# Altium project CNCX.PrjPcb
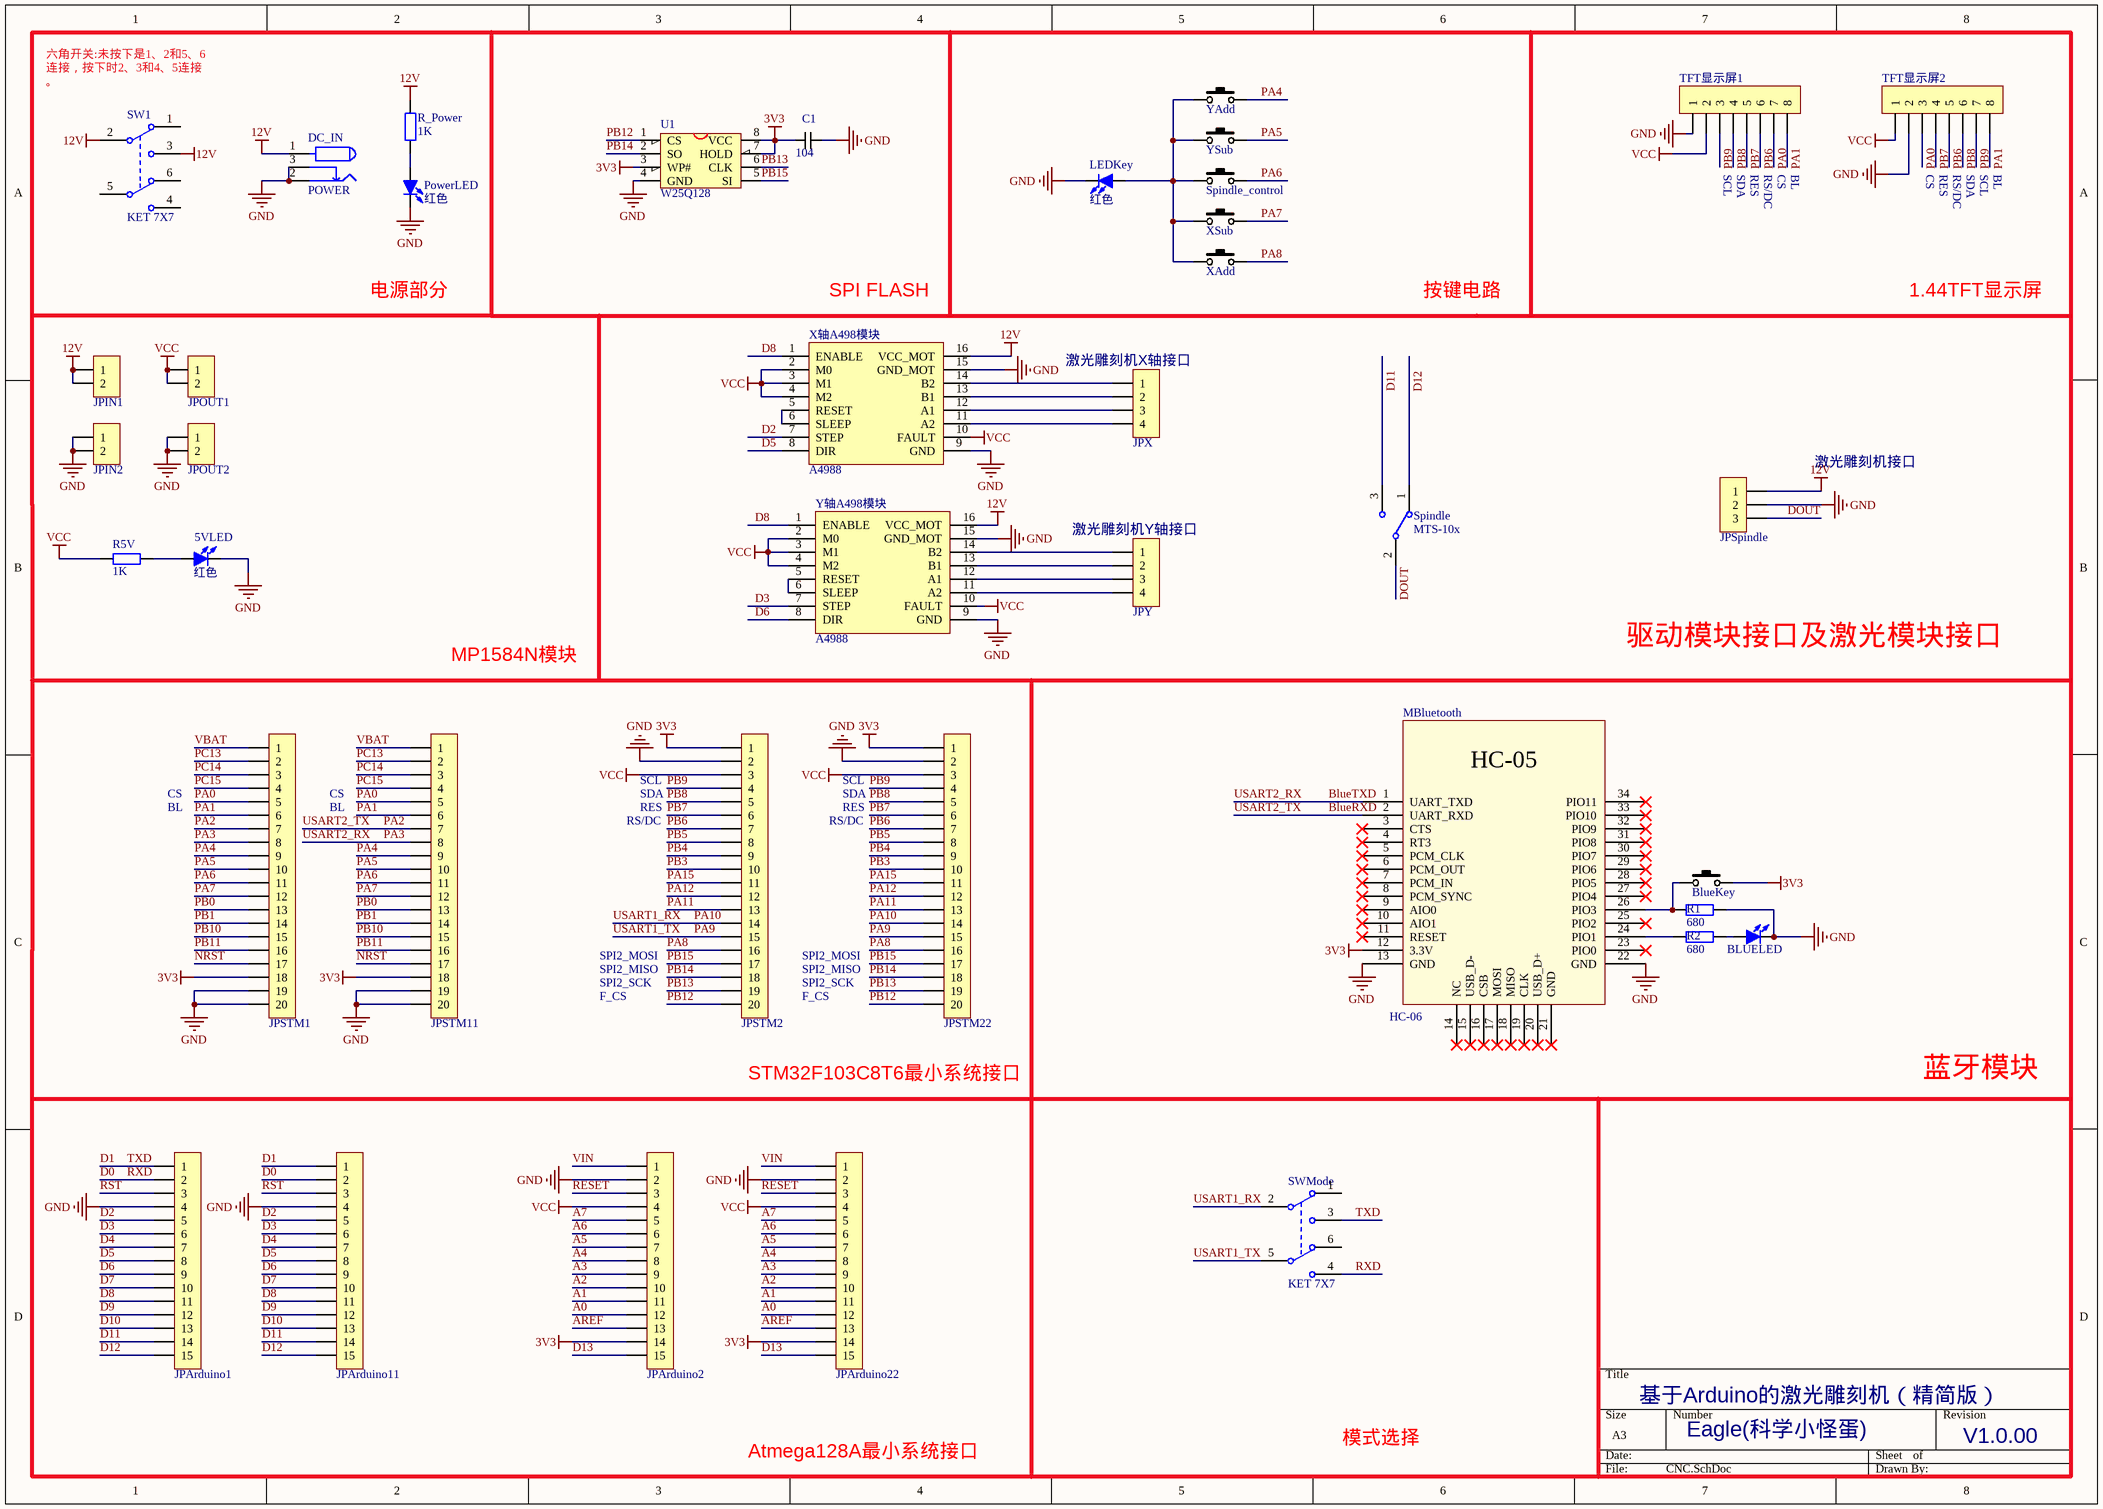
[diagram p0: CNC.SchDoc]
1 sheet, 40 parts. Net scope: global (net labels, ports and power ports of the same name join across sheets).
Board file: CNC.PcbDoc

## Sheet CNC.SchDoc
size A3

### Parts
5VLED  红色  [LED 3MM-B]
BlueKey  Key  [SW-PB]  (value not drawn)
BLUELED  红色  [LED 0805R]  (value not drawn)
C1  cap  [C0805]  (value not drawn)
DC_IN  POWER  [DC10B]
JPArduino1  HDR-1X15  [HDR2.54-LI-15P]  (value not drawn)
JPArduino2  HDR-1X15  [HDR2.54-LI-15P]  (value not drawn)
JPArduino11  HDR-1X15  [HDR2.54-LI-15P]  (value not drawn)
JPArduino22  HDR-1X15  [HDR2.54-LI-15P]  (value not drawn)
JPIN1  HDR-1X2  [HDR2.54-LI-2P]  (value not drawn)
JPIN2  HDR-1X2  [HDR2.54-LI-2P]  (value not drawn)
JPOUT1  HDR-1X2  [HDR2.54-LI-2P]  (value not drawn)
JPOUT2  HDR-1X2  [HDR2.54-LI-2P]  (value not drawn)
JPSpindle  HDR-1X3  [XH2.54-WI-3P]  (value not drawn)
JPSTM1  HDR-1X20  [HDR2.54-LI-20P]  (value not drawn)
JPSTM2  HDR-1X20  [HDR2.54-LI-20P]  (value not drawn)
JPSTM11  HDR-1X20  [HDR2.54-LI-20P]  (value not drawn)
JPSTM22  HDR-1X20  [HDR2.54-LI-20P]  (value not drawn)
JPX  HDR-1X4  [XH2.54-WI-4P]  (value not drawn)
JPY  HDR-1X4  [XH2.54-WI-4P]  (value not drawn)
LEDKey  红色  [LED 5MM-B]
MBluetooth  HC-06  [HC-05]
PowerLED  红色  [LED 3MM-B]
R1  680  [R 0805_L]
R2  680  [R 0805_L]
R5V  1K  [RS 1/4W]
R_Power  1K  [RS 1/4W]
Spindle  MTS-10x  [MTS-10x]
Spindle_control  Key  [SW-PB]  (value not drawn)
SW1  KET 7X7  [KFT DIP-7X7]
SWMode  KET 7X7  [KFT DIP-7X7]
TFT显示屏1  HDR-1X8  [HDR2.54-Y-LI-8P]  (value not drawn)
TFT显示屏2  HDR-1X8  [HDR2.54-Y-LI-8P]  (value not drawn)
U1  W25Q128  [SOIC-8]
XAdd  Key  [SW-PB]  (value not drawn)
XSub  Key  [SW-PB]  (value not drawn)
X轴A498模块  A4988  [DRV8825]
YAdd  Key  [SW-PB]  (value not drawn)
YSub  Key  [SW-PB]  (value not drawn)
Y轴A498模块  A4988  [DRV8825]

### Nets
3V3: BlueKey.3 C1.1 JPArduino2.14 JPArduino22.14 JPSTM1.18 JPSTM2.1 JPSTM11.18 JPSTM22.1 MBluetooth.12(3.3V) U1.3(WP#) U1.7(HOLD) U1.8(VCC)
12V: DC_IN.1 JPIN1.1 JPIN1.2 JPSpindle.1 R_Power.2 SW1.2(COM2) SW1.3(NO1) X轴A498模块.16(VCC_MOT) Y轴A498模块.16(VCC_MOT)
GND: 5VLED.2(K) BLUELED.2(K) C1.2 DC_IN.2 DC_IN.3 JPArduino1.4 JPArduino2.2 JPArduino11.4 JPArduino22.2 JPIN2.1 JPIN2.2 JPOUT2.1 JPOUT2.2 JPSpindle.2 JPSTM1.19 JPSTM1.20 JPSTM2.2 JPSTM11.19 JPSTM11.20 JPSTM22.2 LEDKey.2(K) MBluetooth.13(GND) MBluetooth.22(GND) PowerLED.2(K) R1.1 TFT显示屏1.1 TFT显示屏2.2 U1.4(GND) X轴A498模块.9(GND) X轴A498模块.15(GND_MOT) Y轴A498模块.9(GND) Y轴A498模块.15(GND_MOT)
VCC: JPArduino2.4 JPArduino22.4 JPOUT1.1 JPOUT1.2 JPSTM2.3 JPSTM22.3 R5V.1 TFT显示屏1.2 TFT显示屏2.1 X轴A498模块.2(M0) X轴A498模块.3(M1) X轴A498模块.4(M2) X轴A498模块.10(FAULT) Y轴A498模块.2(M0) Y轴A498模块.3(M1) Y轴A498模块.4(M2) Y轴A498模块.10(FAULT)
A0: JPArduino2.12 JPArduino22.12
A1: JPArduino2.11 JPArduino22.11
A2: JPArduino2.10 JPArduino22.10
A3: JPArduino2.9 JPArduino22.9
A4: JPArduino2.8 JPArduino22.8
A5: JPArduino2.7 JPArduino22.7
A6: JPArduino2.6 JPArduino22.6
A7: JPArduino2.5 JPArduino22.5
AREF: JPArduino2.13 JPArduino22.13
BlueRXD: JPSTM1.7 JPSTM11.7 MBluetooth.2(UART_RXD)  [also labelled PA2, USART2_TX]
BlueTXD: JPSTM1.8 JPSTM11.8 MBluetooth.1(UART_TXD)  [also labelled PA3, USART2_RX]
D0: JPArduino1.2 JPArduino11.2 SWMode.4(NO2)  [also labelled RXD]
D1: JPArduino1.1 JPArduino11.1 SWMode.3(NO1)  [also labelled TXD]
D2: JPArduino1.5 JPArduino11.5 X轴A498模块.7(STEP)
D3: JPArduino1.6 JPArduino11.6 Y轴A498模块.7(STEP)
D4: JPArduino1.7 JPArduino11.7
D5: JPArduino1.8 JPArduino11.8 X轴A498模块.8(DIR)
D6: JPArduino1.9 JPArduino11.9 Y轴A498模块.8(DIR)
D7: JPArduino1.10 JPArduino11.10
D8: JPArduino1.11 JPArduino11.11 X轴A498模块.1(ENABLE) Y轴A498模块.1(ENABLE)
D9: JPArduino1.12 JPArduino11.12
D10: JPArduino1.13 JPArduino11.13
D11: JPArduino1.14 JPArduino11.14 Spindle.3
D12: JPArduino1.15 JPArduino11.15 Spindle.1
D13: JPArduino2.15 JPArduino22.15
DOUT: JPSpindle.3 Spindle.2
NRST: JPSTM1.17 JPSTM11.17
PA0: JPSTM1.5 JPSTM11.5 TFT显示屏1.7 TFT显示屏2.3
PA1: JPSTM1.6 JPSTM11.6 TFT显示屏1.8 TFT显示屏2.8
PA4: JPSTM1.9 JPSTM11.9 YAdd.3
PA5: JPSTM1.10 JPSTM11.10 YSub.3
PA6: JPSTM1.11 JPSTM11.11 Spindle_control.3
PA7: JPSTM1.12 JPSTM11.12 XSub.3
PA8: JPSTM2.16 JPSTM22.16 XAdd.3
PA9: JPSTM2.15 JPSTM22.15 SWMode.5(COM2)  [also labelled USART1_TX]
PA10: JPSTM2.14 JPSTM22.14 SWMode.2(COM2)  [also labelled USART1_RX]
PA11: JPSTM2.13 JPSTM22.13
PA12: JPSTM2.12 JPSTM22.12
PA15: JPSTM2.11 JPSTM22.11
PB0: JPSTM1.13 JPSTM11.13
PB1: JPSTM1.14 JPSTM11.14
PB3: JPSTM2.10 JPSTM22.10
PB4: JPSTM2.9 JPSTM22.9
PB5: JPSTM2.8 JPSTM22.8
PB6: JPSTM2.7 JPSTM22.7 TFT显示屏1.6 TFT显示屏2.5
PB7: JPSTM2.6 JPSTM22.6 TFT显示屏1.5 TFT显示屏2.4
PB8: JPSTM2.5 JPSTM22.5 TFT显示屏1.4 TFT显示屏2.6
PB9: JPSTM2.4 JPSTM22.4 TFT显示屏1.3 TFT显示屏2.7
PB10: JPSTM1.15 JPSTM11.15
PB11: JPSTM1.16 JPSTM11.16
PB12: JPSTM2.20 JPSTM22.20 U1.1(CS)
PB13: JPSTM2.19 JPSTM22.19 U1.6(CLK)
PB14: JPSTM2.18 JPSTM22.18 U1.2(SO)
PB15: JPSTM2.17 JPSTM22.17 U1.5(SI)
PC13: JPSTM1.2 JPSTM11.2
PC14: JPSTM1.3 JPSTM11.3
PC15: JPSTM1.4 JPSTM11.4
RESET: JPArduino2.3 JPArduino22.3
RST: JPArduino1.3 JPArduino11.3
VBAT: JPSTM1.1 JPSTM11.1
VIN: JPArduino2.1 JPArduino22.1
Net5VLED_1: 5VLED.1(A) R5V.2
NetBlueKey_1: BlueKey.1 MBluetooth.26(PIO3) R1.2
NetBLUELED_1: BLUELED.1(A) R2.1
NetJPX_1: JPX.1 X轴A498模块.14(B2)
NetJPX_2: JPX.2 X轴A498模块.13(B1)
NetJPX_3: JPX.3 X轴A498模块.12(A1)
NetJPX_4: JPX.4 X轴A498模块.11(A2)
NetJPY_1: JPY.1 Y轴A498模块.14(B2)
NetJPY_2: JPY.2 Y轴A498模块.13(B1)
NetJPY_3: JPY.3 Y轴A498模块.12(A1)
NetJPY_4: JPY.4 Y轴A498模块.11(A2)
NetLEDKey_1: LEDKey.1(A) Spindle_control.1 XAdd.1 XSub.1 YAdd.1 YSub.1
NetMBluetooth_24: MBluetooth.24(PIO1) R2.2
NetPowerLED_1: PowerLED.1(A) R_Power.1
NetX轴A498模块_5: X轴A498模块.5(RESET) X轴A498模块.6(SLEEP)
NetY轴A498模块_5: Y轴A498模块.5(RESET) Y轴A498模块.6(SLEEP)

Not connected (* = marked no-connect by the designer): MBluetooth 3(CTS)* 4(RT3)* 5(PCM_CLK)* 6(PCM_OUT)* 7(PCM_IN)* 8(PCM_SYNC)* 9(AIO0)* 10(AIO1)* 11(RESET)* 14(NC)* 15(USB_D-)* 16(CSB)* 17(MOSI)* 18(MISO)* 19(CLK)* 20(USB_D+)* 21(GND)* 23(PIO0)* 25(PIO2)* 27(PIO4)* 28(PIO5)* 29(PIO6)* 30(PIO7)* 31(PIO8)* 32(PIO9)* 33(PIO10)* 34(PIO11)*; SW1 1(NC1) 4(NO2) 5(COM2) 6(NC2); SWMode 1(NC1) 6(NC2)

### Notes on the sheet
- (near SW1) 六角开关:未按下是1、2和5、6连接，按下时2、3和4、5连接。
- SCL
- SDA
- RES
- RS/DC
- CS
- BL
- 电源部分
- SPI FLASH
- 按键电路
- 1.44TFT显示屏
- (near JPX) 激光雕刻机X轴接口
- (near JPSpindle) 激光雕刻机接口
- (near JPY) 激光雕刻机Y轴接口
- 驱动模块接口及激光模块接口
- MP1584N模块
- SPI2_SCK
- SPI2_MISO
- SPI2_MOSI
- F_CS
- STM32F103C8T6最小系统接口
- 蓝牙模块
- Atmega128A最小系统接口
- 模式选择
- 基于Arduino的激光雕刻机（精简版）
- Eagle(科学小怪蛋)
- V1.0.00
- (in symbol Cap) 104

### Library data of the parts
5VLED PowerLED = LED-3MM: 插件LED; 版权归属: 源创客; BOM名称: 插件LED; 学习资源: www.ooocke.com
BlueKey Spindle_control XAdd XSub YAdd YSub = Key: 按键
BLUELED = LED-SMD: 贴片LED; 版权归属: 源创客; BOM名称: 贴片LED; 学习资源: www.ooocke.com
C1 = Cap: 电容
DC_IN = POW
JPArduino1 JPArduino2 JPArduino11 JPArduino22 = Header 15: 15P接插件; 版权归属: 源创客; BOM名称: 15P接插件; 学习资源: www.ooocke.com
JPIN1 JPIN2 JPOUT1 JPOUT2 = Header 2: 2P接插件; 版权归属: 源创客; BOM名称: 2P接插件; 学习资源: www.ooocke.com
JPSpindle = Header 3: 3P接插件; 版权归属: 源创客; BOM名称: 3P接插件; 学习资源: www.ooocke.com
JPSTM1 JPSTM2 JPSTM11 JPSTM22 = Header 20: 20P接插件; 版权归属: 源创客; BOM名称: 20P接插件; 学习资源: www.ooocke.com
JPX JPY = Header 4: 4P接插件; 版权归属: 源创客; BOM名称: 4P接插件; 学习资源: www.ooocke.com
LEDKey = LED-5MM: 5mm插件LED; 版权归属: 源创客; BOM名称: 5mm插件LED; 学习资源: www.ooocke.com
MBluetooth = HC-05: 串口蓝牙模块; 版权归属: 源创客; BOM名称: 串口蓝牙模块; 学习资源: www.ooocke.com
R1 R2 = R: 贴片电阻; 版权归属: 源创客; BOM名称: 贴片电阻; 学习资源: www.ooocke.com
R5V R_Power = R-CRR: 直插色环电阻; BOM名称: 色环电阻; 版权归属: 源创客; 学习资源: www.ooocke.com
Spindle = MTS-10x: MTS10x系列3脚扭子开关; 版权归属: 源创客; BOM名称: MTS10x系列3脚扭子开关; 学习资源: www.ooocke.com
SW1 SWMode = KET 7X7: 7*7自锁开关; 版权归属: 源创客; BOM名称: 7*7自锁开关; 学习资源: www.ooocke.com
TFT显示屏1 TFT显示屏2 = Header 8: 8P接插件; 版权归属: 源创客; BOM名称: 8P接插件; 学习资源: www.ooocke.com
U1 = W25X16: W25X16;SST25VF016;MX25L1605
X轴A498模块 Y轴A498模块 = DRV8825: 步进电机驱动模块; 版权归属: 源创客; BOM名称: 步进电机驱动模块; 学习资源: www.ooocke.com